# Altium project project.PrjPcb
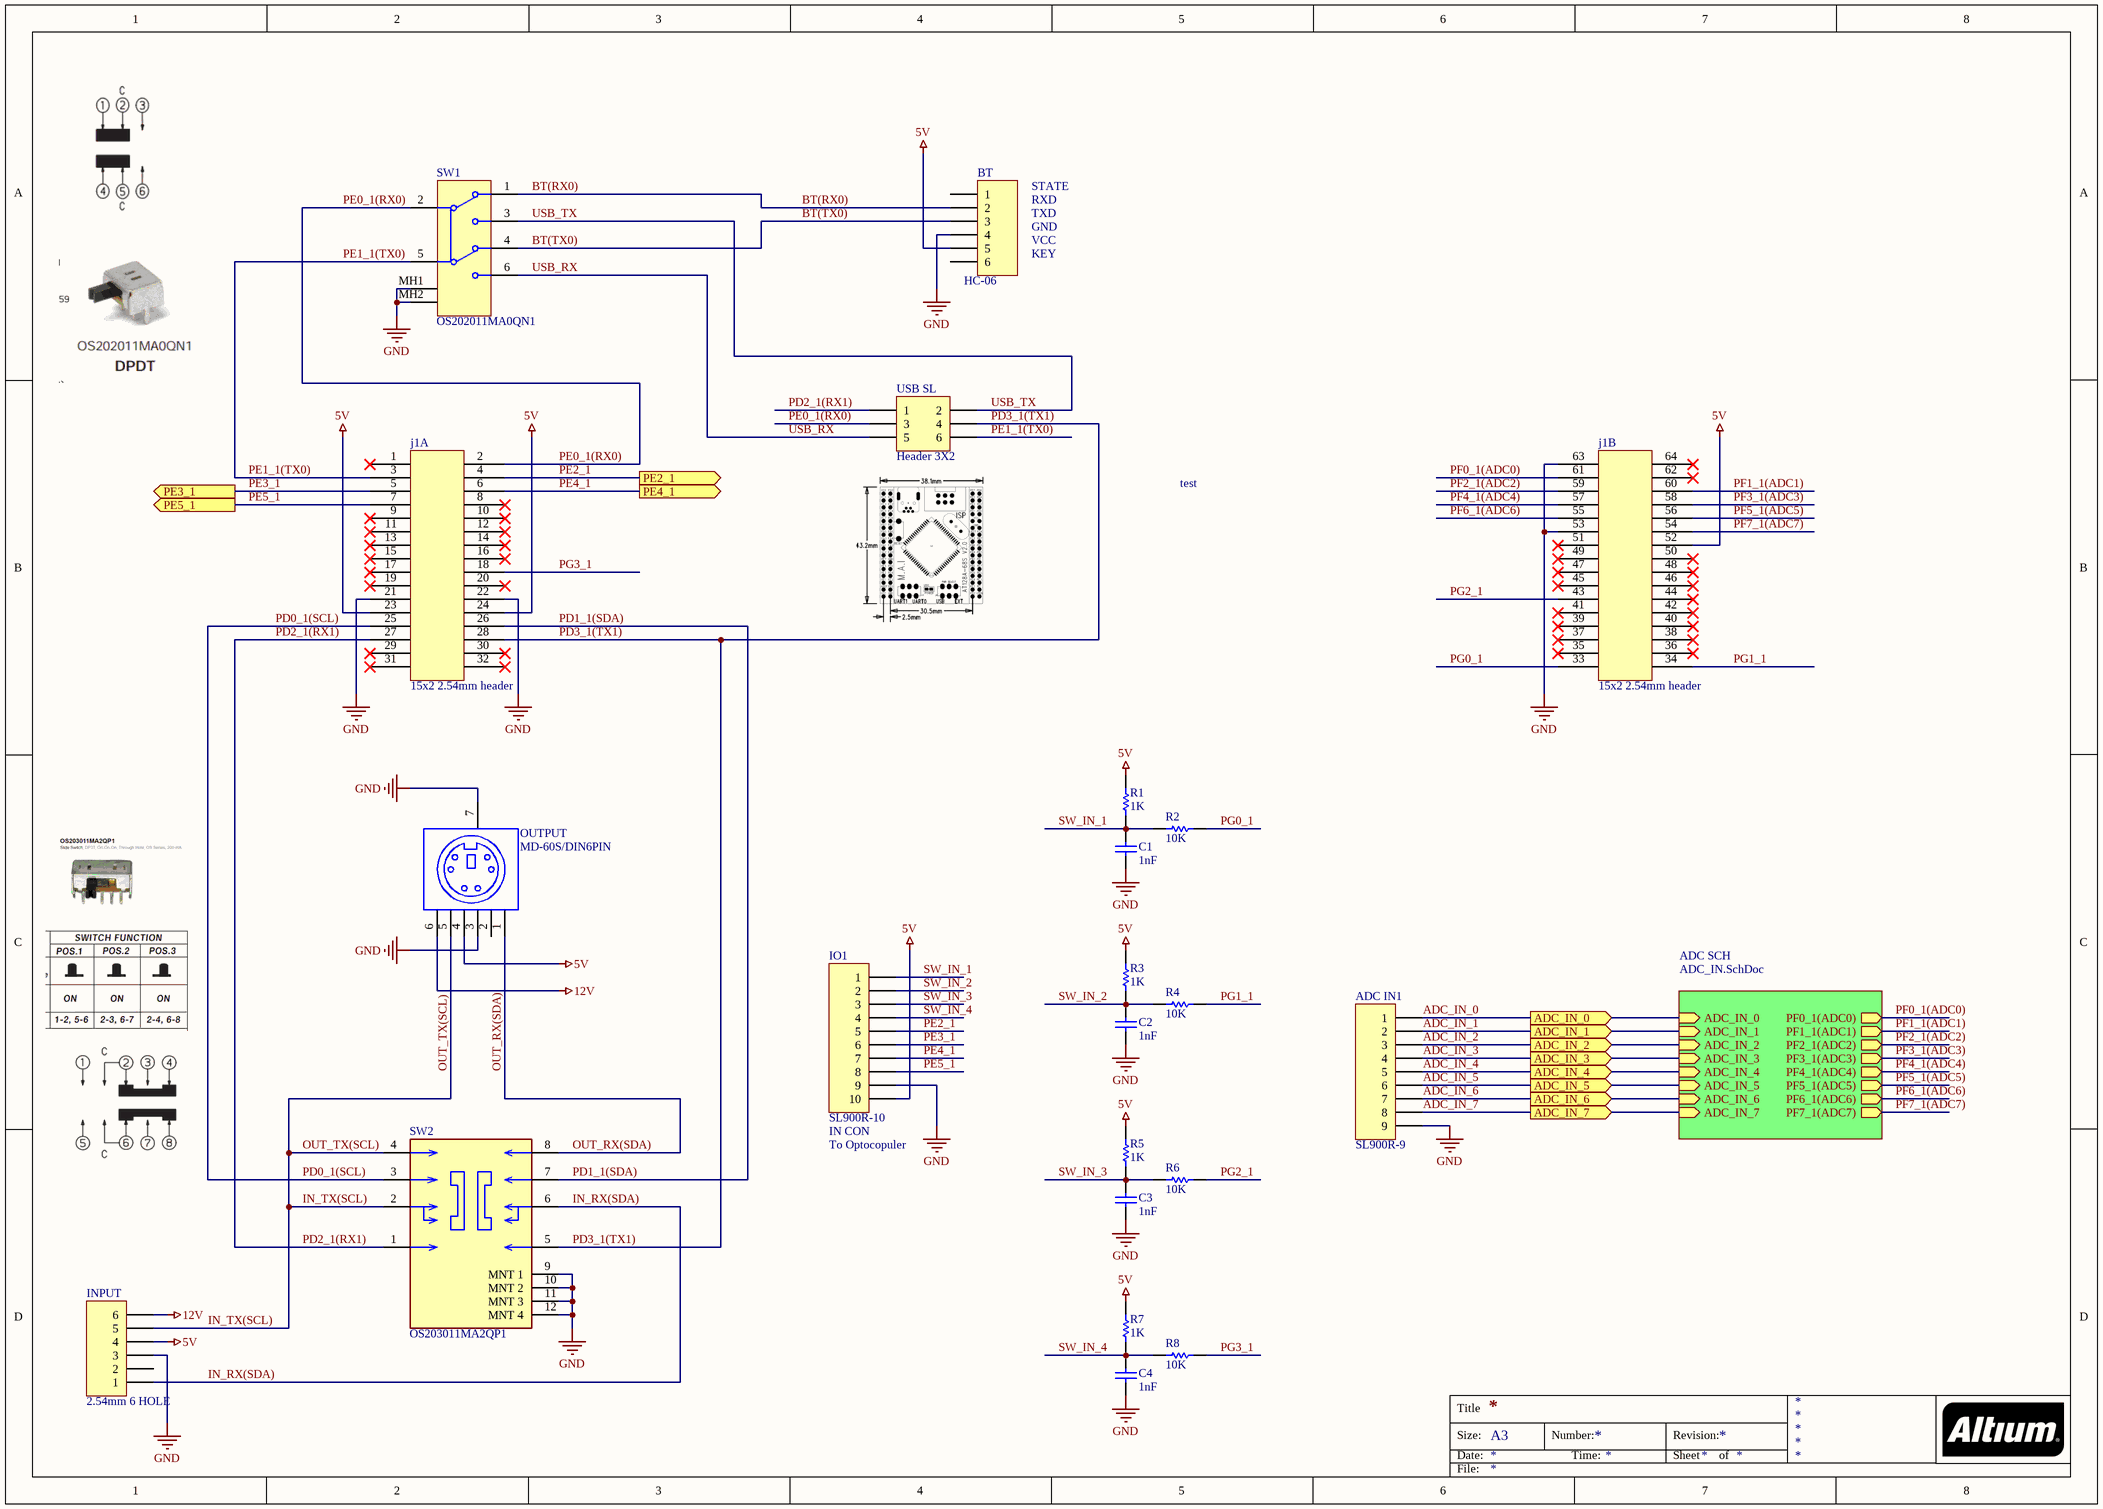
[diagram p0: CON_MCU.SchDoc]
2 sheets, 61 parts. Net scope: hierarchical (ports join the sheet entries above them; power ports are global).
Board files: PCB1.PcbDoc, PCB2.PcbDoc
Sheets:
  CON_MCU.SchDoc
    ADC SCH = ADC_IN.SchDoc

## Sheet CON_MCU.SchDoc
size A3

### Parts
ADC_IN1  SL900R-9  [SR-900R-9]
BT  HC-06  [HC-06]
C1  1nF  [CAPC2013X140X50NL20T25]
C2  1nF  [CAPC2013X140X50NL20T25]
C3  1nF  [CAPC2013X140X50NL20T25]
C4  1nF  [CAPC2013X140X50NL20T25]
INPUT  2.54mm 6 HOLE  [SMW200-06]
IO1  SL900R-10  [SR-900R-10]
j1  15x2 2.54mm header  [Component_1]  (parts A,B of 2)
OUTPUT  MD-60S/DIN6PIN  [CUI-MD-60S_V]
R1  1K  [RESC2113X50X35ML15T15]
R2  10K  [RESC2113X50X35ML15T15]
R3  1K  [RESC2113X50X35ML15T15]
R4  10K  [RESC2113X50X35ML15T15]
R5  1K  [RESC2113X50X35ML15T15]
R6  10K  [RESC2113X50X35ML15T15]
R7  1K  [RESC2113X50X35ML15T15]
R8  10K  [RESC2113X50X35ML15T15]
SW1  OS202011MA0QN1  [TE-1825289-1_V]
SW2  OS203011MA2QP1  [FP-EG2301-MFG]
USB_SL  Header 3X2  [USB SEL]

### Sub-sheets
ADC SCH = ADC_IN.SchDoc: ADC_IN_0 (in), ADC_IN_1 (in), ADC_IN_2 (in), ADC_IN_3 (in), ADC_IN_4 (in), ADC_IN_5 (in), ADC_IN_6 (in), ADC_IN_7 (in), PF0_1(ADC0) (out), PF1_1(ADC1) (out), PF2_1(ADC2) (out), PF3_1(ADC3) (out), PF4_1(ADC4) (out), PF5_1(ADC5) (out), PF6_1(ADC6) (out), PF7_1(ADC7) (out)

### Ports
ADC_IN_0 (out), ADC_IN_1 (out), ADC_IN_2 (out), ADC_IN_3 (out), ADC_IN_4 (out), ADC_IN_5 (out), ADC_IN_6 (out), ADC_IN_7 (out), PE2_1 (out), PE3_1 (out), PE4_1 (out), PE5_1 (out)

### Nets
5V: BT.5 INPUT.4 IO1.10 j1.23 j1.24 j1.52 OUTPUT.4 R1.2 R3.2 R5.2 R7.2
12V: INPUT.6 OUTPUT.6
GND: ADC_IN1.9 BT.4 C1.1 C2.1 C3.1 C4.1 INPUT.3 IO1.9 j1.21 j1.22 j1.53 j1.63 OUTPUT.3 OUTPUT.7 SW1.MH1 SW1.MH2 SW2.9(MNT_1) SW2.10(MNT_2) SW2.11(MNT_3) SW2.12(MNT_4)
ADC_IN_0: ADC_IN1.1 ; port ADC_IN_0, sheet ADC SCH/ADC_IN_0
ADC_IN_1: ADC_IN1.2 ; port ADC_IN_1, sheet ADC SCH/ADC_IN_1
ADC_IN_2: ADC_IN1.3 ; port ADC_IN_2, sheet ADC SCH/ADC_IN_2
ADC_IN_3: ADC_IN1.4 ; port ADC_IN_3, sheet ADC SCH/ADC_IN_3
ADC_IN_4: ADC_IN1.5 ; port ADC_IN_4, sheet ADC SCH/ADC_IN_4
ADC_IN_5: ADC_IN1.6 ; port ADC_IN_5, sheet ADC SCH/ADC_IN_5
ADC_IN_6: ADC_IN1.7 ; port ADC_IN_6, sheet ADC SCH/ADC_IN_6
ADC_IN_7: ADC_IN1.8 ; port ADC_IN_7, sheet ADC SCH/ADC_IN_7
BT(RX0): BT.2 SW1.1
BT(TX0): BT.3 SW1.4
IN_RX(SDA): INPUT.1 SW2.6
IN_TX(SCL): INPUT.5 OUTPUT.5 SW2.2 SW2.4  [also labelled OUT_TX(SCL)]
OUT_RX(SDA): OUTPUT.1 SW2.8
PD0_1(SCL): j1.25 SW2.3
PD1_1(SDA): j1.26 SW2.7
PD2_1(RX1): j1.27 SW2.1 USB_SL.1
PD3_1(TX1): j1.28 SW2.5 USB_SL.4
PE0_1(RX0): j1.2 SW1.2 USB_SL.3
PE1_1(TX0): j1.3 SW1.5 USB_SL.6
PE2_1: IO1.5 j1.4 ; port PE2_1
PE3_1: IO1.6 j1.5 ; port PE3_1
PE4_1: IO1.7 j1.6 ; port PE4_1
PE5_1: IO1.8 j1.7 ; port PE5_1
PF0_1(ADC0): j1.61 ; sheet ADC SCH/PF0_1(ADC0)
PF1_1(ADC1): j1.60 ; sheet ADC SCH/PF1_1(ADC1)
PF2_1(ADC2): j1.59 ; sheet ADC SCH/PF2_1(ADC2)
PF3_1(ADC3): j1.58 ; sheet ADC SCH/PF3_1(ADC3)
PF4_1(ADC4): j1.57 ; sheet ADC SCH/PF4_1(ADC4)
PF5_1(ADC5): j1.56 ; sheet ADC SCH/PF5_1(ADC5)
PF6_1(ADC6): j1.55 ; sheet ADC SCH/PF6_1(ADC6)
PF7_1(ADC7): j1.54 ; sheet ADC SCH/PF7_1(ADC7)
PG0_1: j1.33 R2.1
PG1_1: j1.34 R4.1
PG2_1: j1.43 R6.1
PG3_1: j1.18 R8.1
SW_IN_1: C1.2 IO1.1 R1.1 R2.2
SW_IN_2: C2.2 IO1.2 R3.1 R4.2
SW_IN_3: C3.2 IO1.3 R5.1 R6.2
SW_IN_4: C4.2 IO1.4 R7.1 R8.2
USB_RX: SW1.6 USB_SL.5
USB_TX: SW1.3 USB_SL.2

Not connected (* = marked no-connect by the designer): BT 1 6; INPUT 2; j1 1* 8* 9* 10* 11* 12* 13* 14* 15* 16* 17* 19* 20* 29* 30* 31* 32* 35* 36* 37* 38* 39* 40* 41* 42* 44* 45* 46* 47* 48* 49* 50* 51* 62* 64*; OUTPUT 2

### Notes on the sheet
- STATE
- RXD
- TXD
- GND
- VCC
- KEY
- test
- (near IO1) IN CON
- (near IO1) To Optocopuler
- Title
- Size:
- Date:
- A3
- Number:
- Time:
- Revision:
- Sheet
- of
- File:

### Library data of the parts
ADC_IN1 = Header 9: Header, 9-Pin; LatestRevisionDate: 17-Jul-2002; LatestRevisionNote: Re-released for DXP Platform.; Publisher: Altium Limited
BT INPUT = Header 6: Header, 6-Pin; LatestRevisionDate: 17-Jul-2002; LatestRevisionNote: Re-released for DXP Platform.; Publisher: Altium Limited
C1-C4 = CAP: Manufacturer: AVX Interconnect / Elco; Part Number: 08051A102JAT2A
IO1 = Header 10: Header, 10-Pin; LatestRevisionDate: 17-Jul-2002; LatestRevisionNote: Re-released for DXP Platform.; Publisher: Altium Limited
j1 = Component_1
OUTPUT = CUI-MD-60S-6: Right Angle Mini DIN Connector, 100 Vac, 12 Vdc, -40 to 85 degC, 6-Pin THD, RoHS, Bulk; Manufacturer: CUI Inc; Online Catalog: MD; Other Names: 045-0036RCP-2460MD60S; Connector Type: Receptacle,FemaleSockets; Mating Products: CP-2060-ND-CONNMINI-DIN6PINMALE; Number of Positions: 6; 3D Model: MD-60S; Current Rating: 1A,2A; Voltage - Rated: 100VAC,12VDC; Category: Connectors,Interconnects; Standard Package: 300; Mounting Technology: ThroughHole; RoHS Information: MD-x0SCertofCompliance; Operating Temperature: -40°C~85°C; Contact Finish: Silver; Orientation: Keyed; Package Reference: MD-60S; Package Description: 6-Pin Through Hole Device, Body 14 x 12.4 mm, Height 13.1 mm; Shell Material, Finish: PolybutyleneTerephthalate(PBT); Packaging: Bulk; Fastening Type: Push-Pull; Contact Finish Thickness: -; Shell Size, MIL: -; Termination: Solder; Manufacturer URL: http://www.cui.com/; Family: CircularConnectors; Series: MD; Mounting Type: ThroughHole,RightAngle; Features: -; Ingress Protection: -; Datasheet Version: Rev. 1.02, 03/2012; Datasheet URL: http://www.cui.com/product/resource/md-xxs.pdf; Shell Size - Insert: MiniDIN
R1-R8 = RES-2: Chip Resistor, 4.7 KOhm, +/- 1%, 0.125 W, -55 to 155 degC, 0805 (2012 Metric), RoHS, Tape and Reel; Manufacturer: Vishay Semiconductor; Temperature Coefficient: 100ppm/degreesC; Voltage Rating: 150V; Max Power Dissipation: 125mW; Packaging: TapeandReel; Max Operating Temperature: 155degC; Case Code (Imperial): 0805; Case/Package: 0805; Radiation Hardening: No; Package Reference: 0805; Lead Free: LeadFree; Package Description: 2-Pin Surface Mount Device, Body 2.05 x 1.25 mm; Manufacturer URL: http://www.vishay.com/; Tolerance: 1%; Height: 0.45mm; REACH SVHC: Unknown; Termination: SMD/SMT; Length: 2mm; Depth: 1.25mm; Case Code (Metric): 2012; Package Quantity: 10; Weight: 0.000194oz; Military Standard: Not; RoHSCompliant: true; Composition: ThickFilm; Contact Plating: Tin; Datasheet Version: 41061.0; Datasheet URL: https://datasheet.ciiva.com/11808/0900766b80d98b26-11808992.pdf; Width: 1.25mm; Number of Terminations: 2; Min Operating Temperature: -55degC; Power Rating: 125mW; Resistance: 4.7KOhm; Voltage Rating (DC): 150V
SW1 = SW-DPDT-6: Slide Switch, MHS Series, Double Pole, Vertical, 125 V (AC), -20 to 85 degC, 6-Pin THD, RoHS, Bulk; ComponentLink2Description: Datasheet; DatasheetVersion: Mar-08; PackageDescription: 6-Pin Through Hole Device, Body 16 x 6.7 mm, Height 12.05 mm; ComponentLink1URL: http://www.te.com/; ComponentLink1Description: Manufacturer URL; ComponentLink3Description: Package Specification; ComponentLink2URL: http://www.te.com/commerce/DocumentDelivery/DDEController?Action=showdoc&DocId=Catalog+Section%7F1308111-1_SWITCHES_CORE_PROGRAM_CATALOG%7F0308%7Fpdf%7FEnglish%7FENG_CS_1308111-1_SWITCHES_CORE_PROGRAM_CATALOG_0308.pdf%7F1825289-1; PackageReference: 1825289-1; ComponentLink3URL: http://www.te.com/commerce/DocumentDelivery/DDEController?Action=showdoc&DocId=Customer+Drawing%7F1825289%7FB3%7Fpdf%7FEnglish%7FENG_CD_1825289_B3.pdf%7F1825289-1
SW2 = CMP-17877-000002-1: SWITCH SLIDE DP3T 200MA 30V; Manufacturer Part Number: EG2301; Manufacturer: E-Switch; Electromechanical Life: 10000Cycles; Contact Resistance: 20mΩ; Current Rating: 0.2A; Temperature Range Low: -20°C; Throw Configuration: DP3T; Digikey Description: SWITCH SLIDE DP3T 200MA 30V; Device Class L2: Switches; RoHS: TRUE; Temperature Range High: +70°C; Mount: Through Hole; Lead Free: Yes; ComponentLink2Description: Datasheet; Footprint Url: http://spec_sheets.e-switch.com/specs/P040180.pdf; Category: Switch; Temperature: -20°C to +70°C; Package: EG2301; Automotive: No; Device Class L1: Electromechanical; Device Class L3: Slide Switches; ComponentLink2URL: https://www.e-switch.com/system/asset/product_line/data_sheet/119/EG.pdf; Height: 11.8mm; Octopart: https://octopart.com/eg2301-e-switch-1438660; Mouser Description: Slide Switches DP3T PC MNT SLIDE; Voltage Rating Dc: 30V; Manufacturer 1: E-Switch; Manufacturer Part Number 1: EG2301
USB_SL = Header 3X2: Header, 3-Pin, Dual row; LatestRevisionDate: 17-Jul-2002; LatestRevisionNote: Re-released for DXP Platform.; Publisher: Altium Limited

## Sheet ADC_IN.SchDoc
size A4
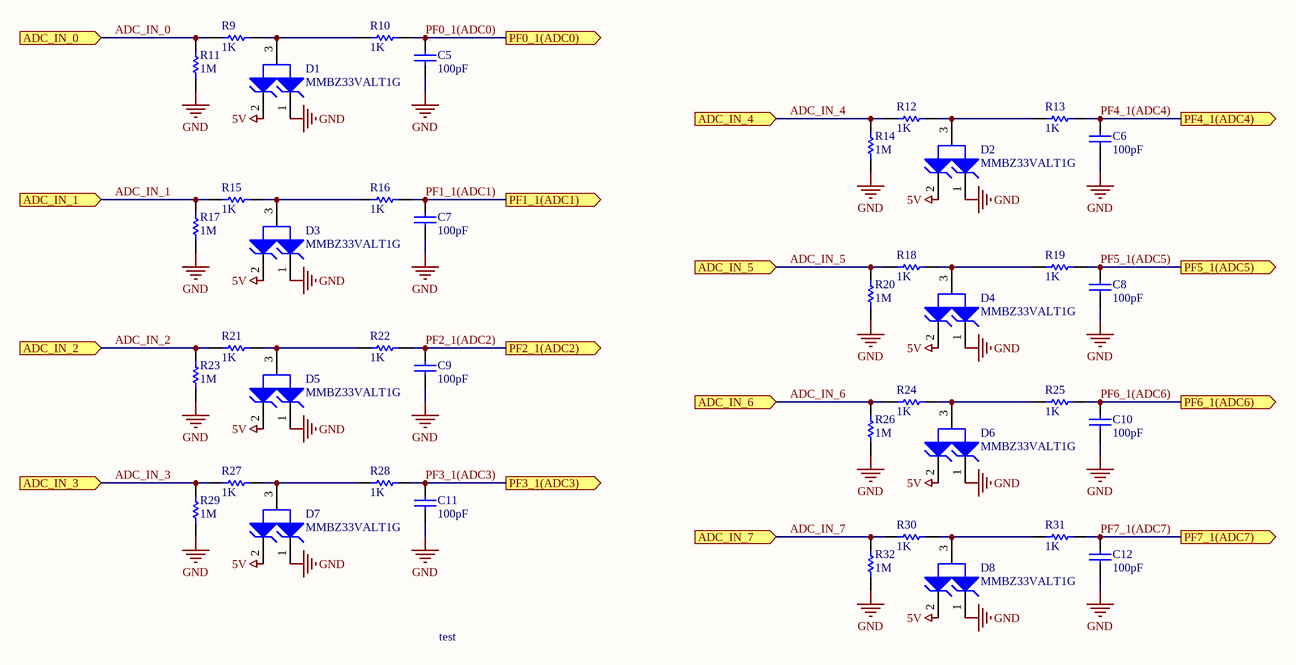
[diagram p1: ADC_IN.SchDoc]

### Parts
C5  100pF  [CAPC2013X140X50NL20T25]
C6  100pF  [CAPC2013X140X50NL20T25]
C7  100pF  [CAPC2013X140X50NL20T25]
C8  100pF  [CAPC2013X140X50NL20T25]
C9  100pF  [CAPC2013X140X50NL20T25]
C10  100pF  [CAPC2013X140X50NL20T25]
C11  100pF  [CAPC2013X140X50NL20T25]
C12  100pF  [CAPC2013X140X50NL20T25]
D1  MMBZ33VALT1G  [ONSC-SOT-23-3-318-08_V]
D2  MMBZ33VALT1G  [ONSC-SOT-23-3-318-08_V]
D3  MMBZ33VALT1G  [ONSC-SOT-23-3-318-08_V]
D4  MMBZ33VALT1G  [ONSC-SOT-23-3-318-08_V]
D5  MMBZ33VALT1G  [ONSC-SOT-23-3-318-08_V]
D6  MMBZ33VALT1G  [ONSC-SOT-23-3-318-08_V]
D7  MMBZ33VALT1G  [ONSC-SOT-23-3-318-08_V]
D8  MMBZ33VALT1G  [ONSC-SOT-23-3-318-08_V]
R9  1K  [RESC2113X50X35ML15T15]
R10  1K  [RESC2113X50X35ML15T15]
R11  1M  [RESC2113X50X35ML15T15]
R12  1K  [RESC2113X50X35ML15T15]
R13  1K  [RESC2113X50X35ML15T15]
R14  1M  [RESC2113X50X35ML15T15]
R15  1K  [RESC2113X50X35ML15T15]
R16  1K  [RESC2113X50X35ML15T15]
R17  1M  [RESC2113X50X35ML15T15]
R18  1K  [RESC2113X50X35ML15T15]
R19  1K  [RESC2113X50X35ML15T15]
R20  1M  [RESC2113X50X35ML15T15]
R21  1K  [RESC2113X50X35ML15T15]
R22  1K  [RESC2113X50X35ML15T15]
R23  1M  [RESC2113X50X35ML15T15]
R24  1K  [RESC2113X50X35ML15T15]
R25  1K  [RESC2113X50X35ML15T15]
R26  1M  [RESC2113X50X35ML15T15]
R27  1K  [RESC2113X50X35ML15T15]
R28  1K  [RESC2113X50X35ML15T15]
R29  1M  [RESC2113X50X35ML15T15]
R30  1K  [RESC2113X50X35ML15T15]
R31  1K  [RESC2113X50X35ML15T15]
R32  1M  [RESC2113X50X35ML15T15]

### Ports
ADC_IN_0 (in), ADC_IN_1 (in), ADC_IN_2 (in), ADC_IN_3 (in), ADC_IN_4 (in), ADC_IN_5 (in), ADC_IN_6 (in), ADC_IN_7 (in), PF0_1(ADC0) (out), PF1_1(ADC1) (out), PF2_1(ADC2) (out), PF3_1(ADC3) (out), PF4_1(ADC4) (out), PF5_1(ADC5) (out), PF6_1(ADC6) (out), PF7_1(ADC7) (out)

### Nets
5V: D1.2(K2) D2.2(K2) D3.2(K2) D4.2(K2) D5.2(K2) D6.2(K2) D7.2(K2) D8.2(K2)
GND: C5.2 C6.2 C7.2 C8.2 C9.2 C10.2 C11.2 C12.2 D1.1(K1) D2.1(K1) D3.1(K1) D4.1(K1) D5.1(K1) D6.1(K1) D7.1(K1) D8.1(K1) R11.2 R14.2 R17.2 R20.2 R23.2 R26.2 R29.2 R32.2
ADC_IN_0: R9.2 R11.1 ; port ADC_IN_0
ADC_IN_1: R15.2 R17.1 ; port ADC_IN_1
ADC_IN_2: R21.2 R23.1 ; port ADC_IN_2
ADC_IN_3: R27.2 R29.1 ; port ADC_IN_3
ADC_IN_4: R12.2 R14.1 ; port ADC_IN_4
ADC_IN_5: R18.2 R20.1 ; port ADC_IN_5
ADC_IN_6: R24.2 R26.1 ; port ADC_IN_6
ADC_IN_7: R30.2 R32.1 ; port ADC_IN_7
PF0_1(ADC0): C5.1 R10.1 ; port PF0_1(ADC0)
PF1_1(ADC1): C7.1 R16.1 ; port PF1_1(ADC1)
PF2_1(ADC2): C9.1 R22.1 ; port PF2_1(ADC2)
PF3_1(ADC3): C11.1 R28.1 ; port PF3_1(ADC3)
PF4_1(ADC4): C6.1 R13.1 ; port PF4_1(ADC4)
PF5_1(ADC5): C8.1 R19.1 ; port PF5_1(ADC5)
PF6_1(ADC6): C10.1 R25.1 ; port PF6_1(ADC6)
PF7_1(ADC7): C12.1 R31.1 ; port PF7_1(ADC7)
NetD1_3: D1.3(A) R9.1 R10.2
NetD2_3: D2.3(A) R12.1 R13.2
NetD3_3: D3.3(A) R15.1 R16.2
NetD4_3: D4.3(A) R18.1 R19.2
NetD5_3: D5.3(A) R21.1 R22.2
NetD6_3: D6.3(A) R24.1 R25.2
NetD7_3: D7.3(A) R27.1 R28.2
NetD8_3: D8.3(A) R30.1 R31.2

### Notes on the sheet
- test
- Title
- Size:
- Date:
- A4
- Number:
- Time:
- Revision:
- Sheet
- of
- File:

### Library data of the parts
C5-C12 = CAP: as C1 on sheet CON_MCU
D1-D8 = ONSC-K1K2A3-3: 40 W Peak Power Zener Transient Voltage Suppressor, Dual Common Anode Zeners for ESD Protection, 3-Pin SOT-23, Pb-Free, Tape and Reel; Manufacturer: On Semiconductor; Direction: Unidirectional; PPK Max (W): 40; IR Max (uA): 0.05; V(BR) Typ (V): 33; PackageReference: SOT-23-3-318-08; RoHS: Pb-Free; PackageDescription: 3-Pin Small Outline Transistor, Body 2.92 x 1.3 mm, Pitch 0.95 mm; Mounting Technology: Surface Mount; PackageVersion: Rev. AP, 11/2009; PartNumber: MMBZ33VALT1G; ComponentLink2Description: Datasheet; DatasheetVersion: Rev. 13; ComponentLink3Description: Package Specification; ComponentLink1Description: Manufacturer URL; Packing: Tape and Reel; ComponentLink3URL: http://www.onsemi.cn/pub_link/Collateral/318-08.PDF; ComponentLink2URL: http://www.onsemi.com/pub_link/Collateral/MMBZ5V6ALT1-D.PDF; ComponentLink1URL: http://www.onsemi.com/
R9-R32 = RES-2: as R1 on sheet CON_MCU; Packaging: TapeandReel; Max Operating Temperature: 155degC; Case Code (Imperial): 0805; Case/Package: 0805; Radiation Hardening: No; Package Reference: 0805; Lead Free: LeadFree; Package Description: 2-Pin Surface Mount Device, Body 2.05 x 1.25 mm; Manufacturer URL: http://www.vishay.com/; Tolerance: 1%; Height: 0.45mm; REACH SVHC: Unknown; Termination: SMD/SMT; Length: 2mm; Depth: 1.25mm; Case Code (Metric): 2012; Package Quantity: 10; Weight: 0.000194oz; Military Standard: Not; RoHSCompliant: true; Composition: ThickFilm; Contact Plating: Tin; Datasheet Version: 41061.0; Datasheet URL: https://datasheet.ciiva.com/11808/0900766b80d98b26-11808992.pdf; Width: 1.25mm; Number of Terminations: 2; Min Operating Temperature: -55degC; Power Rating: 125mW; Resistance: 4.7KOhm; Voltage Rating (DC): 150V

## Nets that join several sheets
5V: CON_MCU (11 pins), ADC_IN (8 pins)
GND: CON_MCU (20 pins), ADC_IN (24 pins)
ADC_IN_0: CON_MCU (ADC_IN1.1), ADC_IN (R9.2 R11.1)
ADC_IN_1: CON_MCU (ADC_IN1.2), ADC_IN (R15.2 R17.1)
ADC_IN_2: CON_MCU (ADC_IN1.3), ADC_IN (R21.2 R23.1)
ADC_IN_3: CON_MCU (ADC_IN1.4), ADC_IN (R27.2 R29.1)
ADC_IN_4: CON_MCU (ADC_IN1.5), ADC_IN (R12.2 R14.1)
ADC_IN_5: CON_MCU (ADC_IN1.6), ADC_IN (R18.2 R20.1)
ADC_IN_6: CON_MCU (ADC_IN1.7), ADC_IN (R24.2 R26.1)
ADC_IN_7: CON_MCU (ADC_IN1.8), ADC_IN (R30.2 R32.1)
PF0_1(ADC0): CON_MCU (j1.61), ADC_IN (C5.1 R10.1)
PF1_1(ADC1): CON_MCU (j1.60), ADC_IN (C7.1 R16.1)
PF2_1(ADC2): CON_MCU (j1.59), ADC_IN (C9.1 R22.1)
PF3_1(ADC3): CON_MCU (j1.58), ADC_IN (C11.1 R28.1)
PF4_1(ADC4): CON_MCU (j1.57), ADC_IN (C6.1 R13.1)
PF5_1(ADC5): CON_MCU (j1.56), ADC_IN (C8.1 R19.1)
PF6_1(ADC6): CON_MCU (j1.55), ADC_IN (C10.1 R25.1)
PF7_1(ADC7): CON_MCU (j1.54), ADC_IN (C12.1 R31.1)